# EasyEDA Pro project ProDoc_主板V6.0_2025-09-29.epro, board PCB8_4
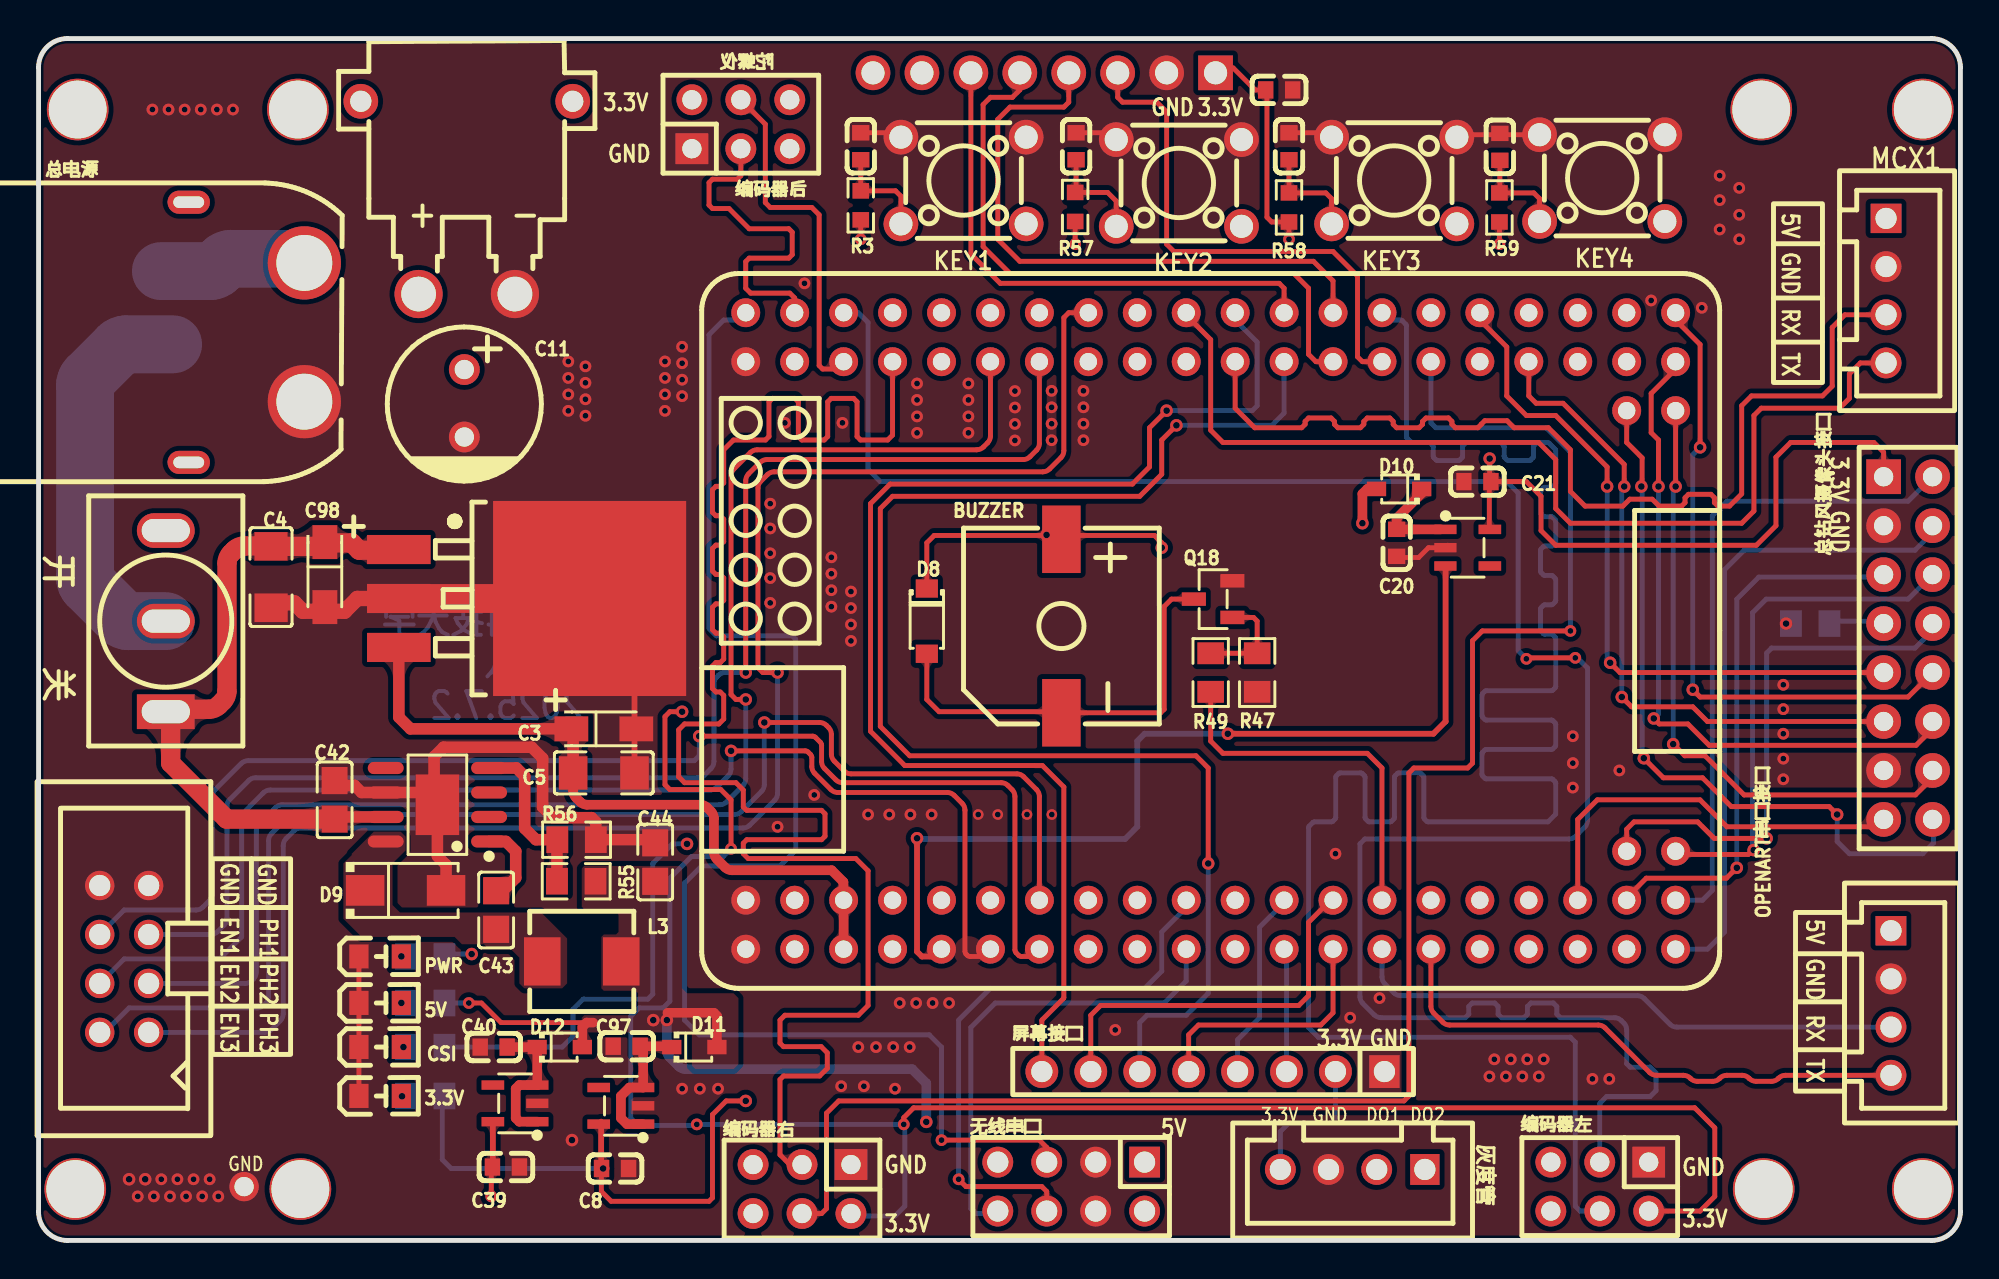
[diagram p1: board, top side]
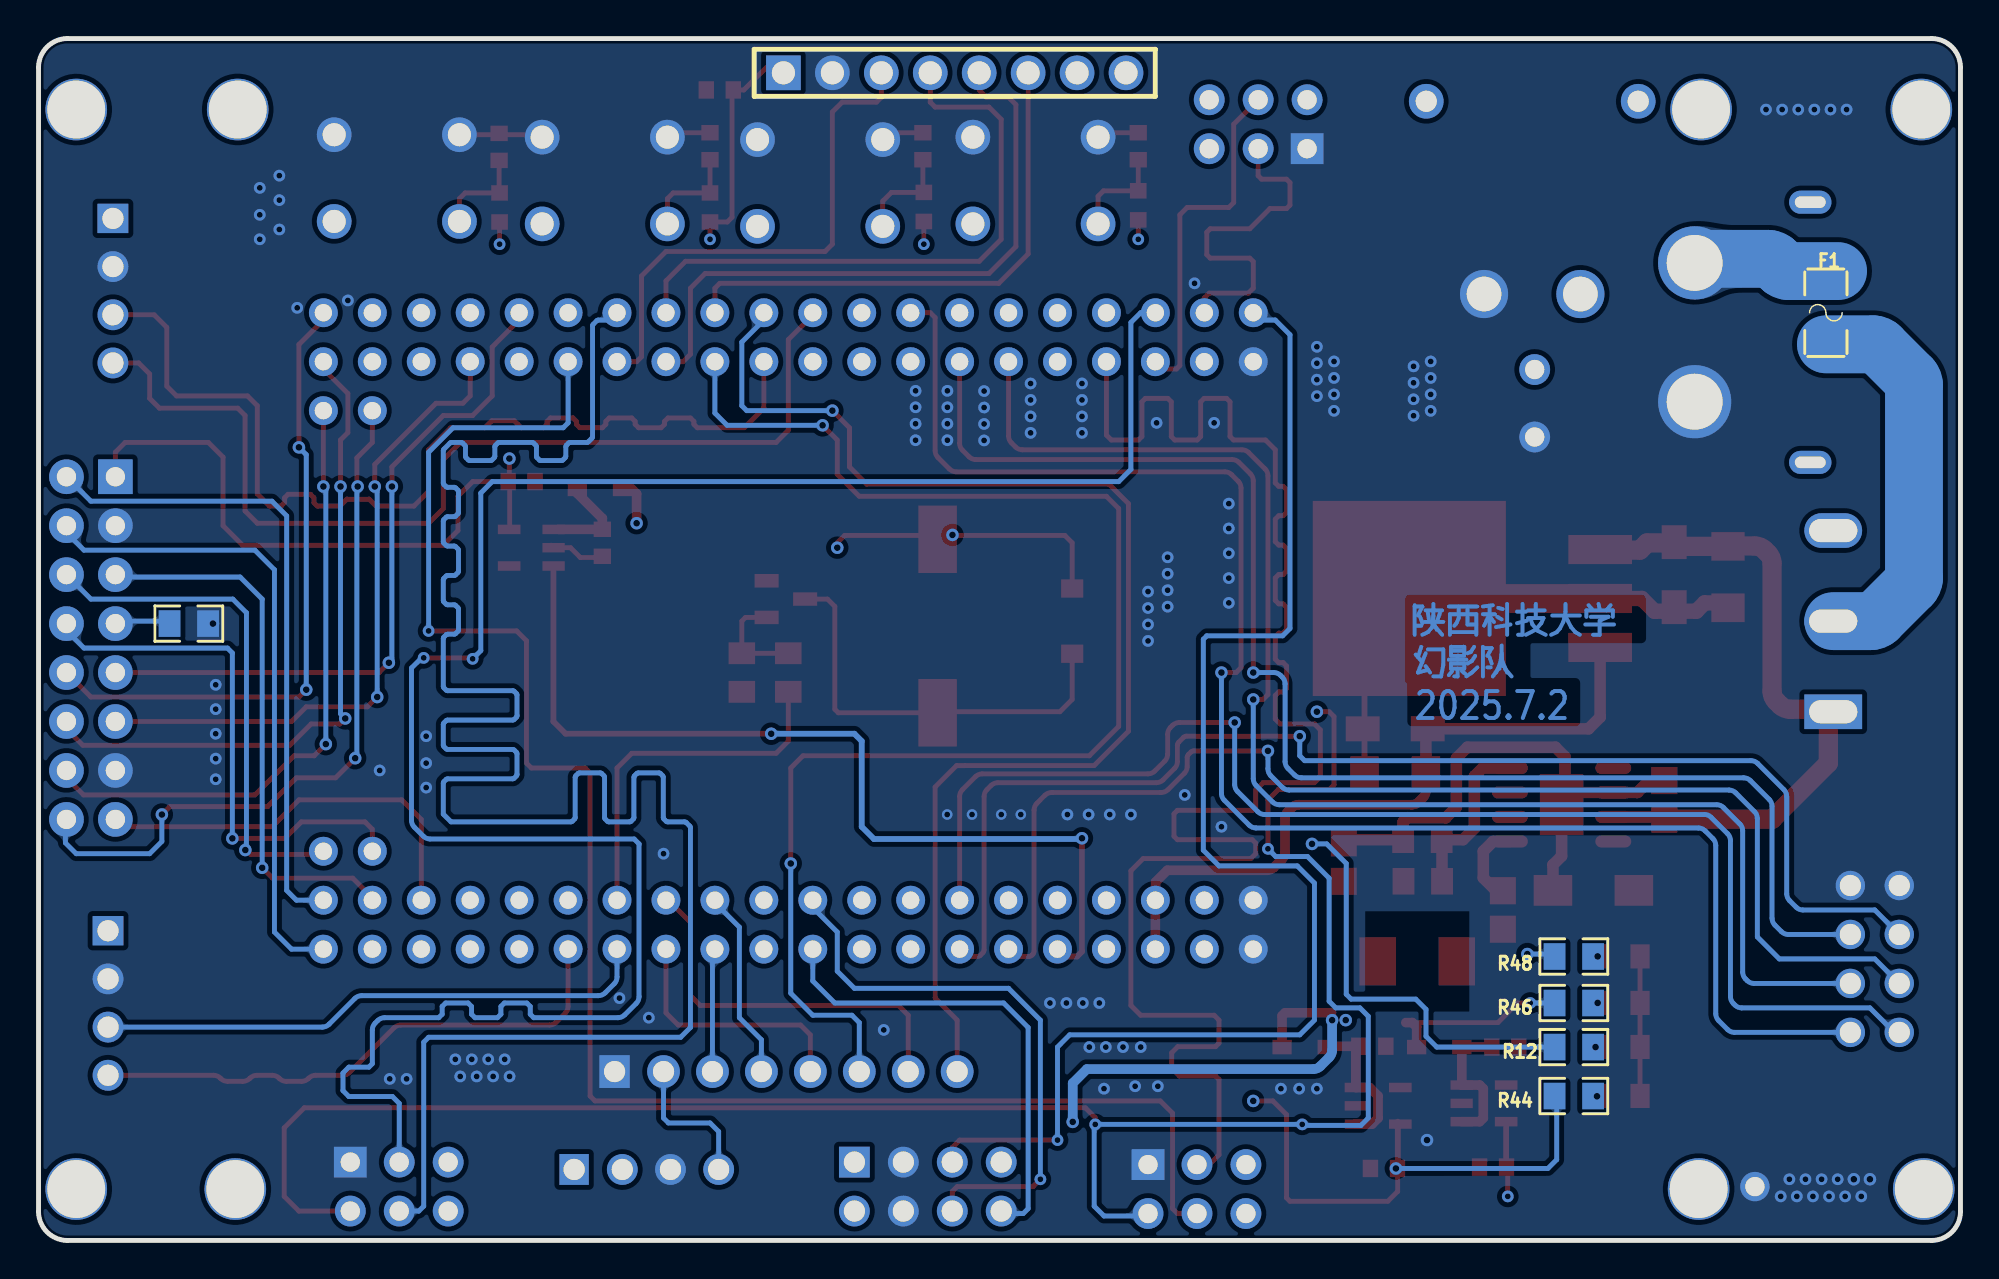
[diagram p2: board, bottom side, seen from below]

Outline 99.75 x 62.36 mm; copper layers: Top Layer, Inner1, Inner2, Bottom Layer. Coordinates in mm from the lower left corner of the outline.
Outline path: 0,60.86 0,1.5 arc(0.44,0.44) 1.5,0 98.25,0 arc(99.31,0.44) 99.75,1.5 99.75,60.86 arc(99.31,61.92) 98.25,62.36 1.5,62.36 arc(0.44,61.92) 0,60.86
Stack: Top Layer 0.035mm 外层铜厚1oz / Dielectric1 0.2104mm 7628 RC49% 8.6mil / Inner1 0.0152mm 内层铜厚 / Dielectric2 1.065mm 1.1mm H/HOZ Copper / Inner2 0.0152mm 内层铜厚 / Dielectric3 0.2104mm 7628 RC49% 8.6mil / Bottom Layer 0.035mm 外层铜厚1oz

## Design rules (mm)
net BM1_A: DP3
net BM2_A: DP2
net BM1_B: DP3
net BM3_A: DP1
net BM2_B: DP2
net BM3_B: DP1
template: 自定义配置
spacing copperThickness1oz (default): track to track 0.102, other pairs 0.152 to 0.3
spacing copperThickness2oz: track to track 0.203, other pairs 0.152 to 0.3
track width copperThickness1oz (default): min 0.127, default 0.254, max 4
track width copperThickness2oz: min 0.203, default 0.254, max 2.54
differential pair differentialPair (default): width min 0.127, default 0.254, max 2.54; gap min 0.152, default 0.152
via viaSize (default): diameter min 0.5, default 0.61, max 10; hole min 0.3, default 0.305, max 6.3

## Placement (name value [footprint] x y rotation side)
3.3V  -  [led_0805]  17.78 7.49 0 top
5V  -  [led_0805]  17.78 12.32 0 top
BUZZER  2.7kHz  [BUZ-SMD_L9.6-W9.6-LS10.0-R]  53.09 31.88 90 top
C2  100nF  [C0603]  42.67 56.77 90 top
C3  10uF  [CAP-SMD_L3.2-W1.6-RD-C7171]  29.34 26.54 0 top
C4  100nF  [C1206]  12.06 34.42 90 top
C5  100nF  [C1206]  29.34 24.26 180 top
C8  1uf  [C0603]  29.92 3.73 180 top
C11  220uF  [CAP-TH_BD8.0-P3.50-D0.5-FD]  22.1 43.43 270 top
C20  1uf  [C0603]  70.48 36.19 90 top
C21  1uf  [C0603]  74.68 39.37 0 top
C39  1uf  [C0603]  24.26 3.81 180 top
C40  1uf  [C0603]  23.62 10.03 0 top
C42  22uf  [C0805]  15.37 22.86 90 top
C43  10nF  [C0805]  23.75 17.14 270 top
C44  22uf  [C0805]  32 19.63 90 top
C95  100nF  [C0603]  53.85 56.77 90 top
C97  1uf  [C0603]  30.52 10.08 0 top
C98  10uF  [CAP-SMD_L3.2-W1.6-RD-C7171]  14.86 34.54 270 top
C99  100nF  [C0603]  64.9 56.77 90 top
C100  100nF  [C0603]  75.84 56.74 90 top
C101  100nF  [C0603]  64.39 59.69 0 top
CN7  XT30PW-M  [CONN-TH_XT30PW-M]  22.22 54.1 180 top
CSI  -  [led_0805]  17.78 10.03 0 top
D8  1N4148W  [SOD-123_L2.8-W1.8-LS3.7-RD]  46.1 32.13 270 top
D9  SS34  [SMA_L4.3-W2.5-LS5.0-RD]  19.05 18.16 0 top
D10  1N5819WS  [SOD-323_L1.8-W1.3-LS2.5-RD]  70.61 38.99 180 top
D11  1N5819WS  [SOD-323_L1.8-W1.3-LS2.5-RD]  34.04 10.03 0 top
D12  1N5819WS  [SOD-323_L1.8-W1.3-LS2.5-RD]  27.05 10.03 0 top
F1  R12.000.6  [F1206]  6.98 48.13 90 bottom
KEY1  TS665CJ  [SW-TH_4P-L6.0-W6.0-P4.50-LS6.5]  48.01 54.99 180 top
KEY2  TS665CJ  [SW-TH_4P-L6.0-W6.0-P4.50-LS6.5]  59.18 54.86 180 top
KEY3  TS665CJ  [SW-TH_4P-L6.0-W6.0-P4.50-LS6.5]  70.36 54.99 180 top
KEY4  TS665CJ  [SW-TH_4P-L6.0-W6.0-P4.50-LS6.5]  81.15 55.12 180 top
L3  10uH  [IND-SMD_L5.4-W5.2_FXL0530]  28.19 14.48 0 top
MCX串口接口  ZX-XH2.54-4PZZ  [CONN-TH_4P-P2.50_4PIN]  95.89 49.28 270 top
NOREF  -  [Pad_e85]  13.46 58.67 0 top
NOREF#2  -  [Pad_e4]  1.91 2.67 0 top
NOREF#3  -  [Pad_e79]  89.53 2.67 0 top
NOREF#4  -  [Pad_e82]  89.41 58.67 0 top
NOREF#5  -  [Pad_e78]  13.59 2.67 0 top
NOREF#6  -  [Pad_e1]  97.79 58.67 0 top
NOREF#7  -  [Pad_e3]  97.79 2.67 0 top
NOREF#8  -  [Pad_e5]  2.03 58.67 0 top
NOREF#9  -  [Pad_e1237]  10.67 2.79 0 top
OPENART串口接口  ZX-XH2.54-4PZZ  [CONN-TH_4P-P2.50_4PIN]  96.14 12.32 270 top
PWR  -  [led_0805]  17.78 14.73 0 top
Q18  S8050  [SOT-23-3_L2.9-W1.3-P1.90-LS2.4-BR]  60.96 33.27 0 top
R3  10K  [R0603]  42.67 53.7 270 top
R12  510  [R0805]  20.07 10.03 0 bottom
R44  510  [R0805]  20.07 7.49 0 bottom
R46  2k  [R0805]  20.07 12.32 0 bottom
R47  4.7k  [R0805]  63.25 29.46 90 top
R48  2k  [R0805]  20.07 14.73 0 bottom
R49  4.7k  [R0805]  60.83 29.46 90 top
R50  10K  [R0805]  91.95 32 0 bottom
R55  10k  [R0805]  27.91 18.63 0 top
R56  3.24k  [R0805]  27.92 20.79 180 top
R57  10K  [R0603]  53.8 53.62 270 top
R58  10K  [R0603]  64.9 53.59 270 top
R59  10K  [R0603]  75.82 53.59 270 top
U1  LM2940S-5.0/TR  [TO-263-3_L8.6-W10.2-P2.54-LS14.4-BR]  23.65 33.31 180 top
U15  HC-JN254-2-04-Z  [IDC-TH_8P-P2.54-V-R2-C4-S2.54]  4.44 14.6 90 top
U20  RT9013-33GB  [SOT-23-5_L3.0-W1.7-P0.95-LS2.8-BL]  74.17 35.94 270 top
U21  RT9013-33GB  [SOT-23-5_L3.0-W1.7-P0.95-LS2.8-BL]  30.23 6.98 90 top
U33  RT9013-33GB  [SOT-23-5_L3.0-W1.7-P0.95-LS2.8-BL]  24.73 7.11 90 top
U34  TPS5430DDA  [ESOP-8_L4.9-W3.9-P1.27-LS6.0-BL-EP-2]  20.7 22.61 90 top
U38  -  [NXPRT1064]  33.27 50.8 0 top
U39  MT-0-102-A101-M200-RS  [SW-TH_MT-0-103-A101-M200-RS]  6.6 32.13 90 top
U40  ZX-XH2.54-4PZZ  [CONN-TH_4P-P2.50_4PIN]  68.2 3.68 180 top
屏幕接口  PM254-1-08-Z-8.5  [HDR-TH_8P-P2.54-V-F]  60.96 8.76 180 top
总电源  XT60PW-M  [CONN-TH_XT60PW-M]  10.8 47.12 0 top
总钻风摄像头接口  PM254-2-08-Z-8.5  [HDR-TH_16P-P2.54-V-F-R2-C8-S2.54]  97.03 30.73 270 top
无线串口  -  [HDR-TH_8P-P2.54-V-F-R2-C4-S2.54-1]  53.59 2.79 180 top
编码器右  -  [HDR-TH_6P-P2.54-V-F-R2-C3-S2.54]  39.62 2.67 180 top
编码器后  -  [HDR-TH_6P-P2.54-V-F-R2-C3-S2.54]  36.45 57.91 0 top
编码器左  -  [HDR-TH_6P-P2.54-V-F-R2-C3-S2.54]  81.03 2.79 180 top
陀螺仪  -  [HDR-TH_8P-P2.54-V-F-1]  52.2 60.58 180 bottom

## Footprints (pads in the part's own frame, mm; a bottom-side part is the same pattern mirrored in y, then rotated)
BUZ-SMD_L9.6-W9.6-LS10.0-R
  rect 3.5x2 smd: 1(4.5,0) 2(-4.5,0)
C0603
  rect 0.8x0.9 smd: 1(-0.7,0) 2(0.7,0)
C0805
  rect 1.41x1.35 smd: 1(-1,0) 2(1,0)
C1206
  rect 1.485x1.728 smd: 1(-1.593,0) 2(1.593,0)
CAP-SMD_L3.2-W1.6-RD-C7171
  rect 1.758x1.296 smd: 1(-1.687,0) 2(1.687,0)
CAP-TH_BD8.0-P3.50-D0.5-FD
  round 1.6 hole 1: 1(-1.75,0) 2(1.75,0)
CONN-TH_4P-P2.50_4PIN
  rect 1.524x1.6 hole 1.1: 1(-3.75,0)
  round 1.6 hole 1.1: 2(-1.25,0) 3(1.25,0) 4(3.75,0)
CONN-TH_XT30PW-M
  round 2.5 hole 1.8: 1(-2.5,5) 2(2.5,5)
  round 1.8 hole 1.1: 3(5.5,-5) 4(-5.5,-5)
CONN-TH_XT60PW-M
  round 3.8 hole 2.9: 1(3,-3.6) 2(3,3.6)
  oval 2.2x1.2 hole 1.6x0.6: 3(-3,6.75) 4(-3,-6.75)
ESOP-8_L4.9-W3.9-P1.27-LS6.0-BL-EP-2
  oval 0.63x1.865 smd: 1(-1.905,-2.683) 2(-0.635,-2.683) 3(0.635,-2.683) 4(1.905,-2.683) 5(1.905,2.683) 6(0.635,2.683) 7(-0.635,2.683) 8(-1.905,2.683)
  rect 3.15x2.26 smd: 9(0,0)
F1206
  rect 1.19x1.728 smd: 1(-1.445,0) 2(1.445,0)
HDR-TH_6P-P2.54-V-F-R2-C3-S2.54
  rect 1.7x1.6 hole 1: 1(-2.54,-1.27)
  round 1.6 hole 1: 2(-2.54,1.27) 3(0,-1.27) 4(0,1.27) 5(2.54,-1.27) 6(2.54,1.27)
HDR-TH_8P-P2.54-V-F
  rect 1.575x1.7 hole 1.1: 1(-8.89,0)
  round 1.7 hole 1.1: 2(-6.35,0) 3(-3.81,0) 4(-1.27,0) 5(1.27,0) 6(3.81,0) 7(6.35,0) 8(8.89,0)
HDR-TH_8P-P2.54-V-F-1
  rect 1.8x1.8 hole 1.2: 1(-8.89,0)
  round 1.8 hole 1.2: 2(-6.35,0) 3(-3.81,0) 4(-1.27,0) 5(1.27,0) 6(3.81,0) 7(6.35,0) 8(8.89,0)
HDR-TH_8P-P2.54-V-F-R2-C4-S2.54-1
  rect 1.6x1.6 hole 1.1: 1(-3.81,-1.27)
  round 1.6 hole 1.1: 2(-3.81,1.27) 3(-1.27,-1.27) 4(-1.27,1.27) 5(1.27,-1.27) 6(1.27,1.27) 7(3.81,-1.27) 8(3.81,1.27)
HDR-TH_16P-P2.54-V-F-R2-C8-S2.54
  rect 1.8x1.8 hole 1: 1(-8.89,-1.27)
  round 1.8 hole 1: 2(-8.89,1.27) 3(-6.35,-1.27) 4(-6.35,1.27) 5(-3.81,-1.27) 6(-3.81,1.27) 7(-1.27,-1.27) 8(-1.27,1.27) 9(1.27,-1.27) 10(1.27,1.27) 11(3.81,-1.27) 12(3.81,1.27) 13(6.35,-1.27) 14(6.35,1.27) 15(8.89,-1.27) 16(8.89,1.27)
IDC-TH_8P-P2.54-V-R2-C4-S2.54
  round 1.524 hole 1.1: 1(-3.81,-1.27) 2(-3.81,1.27) 3(-1.27,-1.27) 4(-1.27,1.27) 5(1.27,-1.27) 6(1.27,1.27) 7(3.81,-1.27) 8(3.81,1.27)
IND-SMD_L5.4-W5.2_FXL0530
  rect 1.9x2.5 smd: 1(-2.05,0) 2(2.05,0)
led_0805
  rect 1x1.25 smd: 1(-1.15,0.005) 2(1.05,0.005)
NXPRT1064
  round 1.5 hole 0.9: 1(3.429,-35.687) 2(3.429,-33.147) 3(5.969,-35.687) 4(5.969,-33.147) 5(8.509,-35.687) 6(8.509,-33.147) 7(11.049,-35.687) 8(11.049,-33.147) 9(13.589,-35.687) 10(13.589,-33.147) 11(16.129,-35.687) 12(16.129,-33.147) 13(18.669,-35.687) 14(18.669,-33.147) 15(21.209,-35.687) 16(21.209,-33.147) 17(23.749,-35.687) 18(23.749,-33.147) 19(26.289,-35.687) 20(26.289,-33.147) 21(28.829,-35.687) 22(28.829,-33.147) 23(31.369,-35.687) 24(31.369,-33.147) 25(33.909,-35.687) 26(33.909,-33.147) 27(36.449,-35.687) 28(36.449,-33.147) 29(38.989,-35.687) 30(38.989,-33.147) 31(41.529,-35.687) 32(41.529,-33.147) 33(44.069,-35.687) 34(44.069,-33.147) 35(46.609,-35.687) 36(46.609,-33.147) 37(49.149,-35.687) 38(49.149,-33.147) 39(51.689,-35.687) 40(51.689,-33.147) 41(49.149,-30.607) 42(51.689,-30.607) 43(51.689,-7.747) 44(49.149,-7.747) 45(51.689,-5.207) 46(51.689,-2.667) 47(49.149,-5.207) 48(49.149,-2.667) 49(46.609,-5.207) 50(46.609,-2.667) 51(44.069,-5.207) 52(44.069,-2.667) 53(41.529,-5.207) 54(41.529,-2.667) 55(38.989,-5.207) 56(38.989,-2.667) 57(36.449,-5.207) 58(36.449,-2.667) 59(33.909,-5.207) 60(33.909,-2.667) 61(31.369,-5.207) 62(31.369,-2.667) 63(28.829,-5.207) 64(28.829,-2.667) 65(26.289,-5.207) 66(26.289,-2.667) 67(23.749,-5.207) 68(23.749,-2.667) 69(21.209,-5.207) 70(21.209,-2.667) 71(18.669,-5.207) 72(18.669,-2.667) 73(16.129,-5.207) 74(16.129,-2.667) 75(13.589,-5.207) 76(13.589,-2.667) 77(11.049,-5.207) 78(11.049,-2.667) 79(8.509,-5.207) 80(8.509,-2.667) 81(5.969,-5.207) 82(5.969,-2.667) 83(3.429,-5.207) 84(3.429,-2.667)
Pad_e1
  round 3.2 hole 3: 1(0,0)
Pad_e3
  round 3.2 hole 3: 1(0,0)
Pad_e4
  round 3.2 hole 3: 1(0,0)
Pad_e5
  round 3.2 hole 3: 1(0,0)
Pad_e78
  round 3.2 hole 3: 1(0,0)
Pad_e79
  round 3.2 hole 3: 1(0,0)
Pad_e82
  round 3.2 hole 3: 1(0,0)
Pad_e85
  round 3.2 hole 3: 1(0,0)
Pad_e1237
  round 1.524 hole 1: 1(0,0)
R0603
  rect 0.806x0.864 smd: 1(-0.753,0) 2(0.753,0)
R0805
  rect 1.133x1.377 smd: 1(-1,0) 2(1,0)
SMA_L4.3-W2.5-LS5.0-RD
  rect 2x1.593 smd: 1(-2.1,0) 2(2.1,0)
SOD-123_L2.8-W1.8-LS3.7-RD
  rect 0.95x1.15 smd: 1(-1.692,0) 2(1.692,0)
SOD-323_L1.8-W1.3-LS2.5-RD
  rect 1x0.75 smd: 1(-1.173,0) 2(1.173,0)
SOT-23-3_L2.9-W1.3-P1.90-LS2.4-BR
  rect 1.25x0.7 smd: 1(1,-0.95) 2(1,0.95) 3(-1,0)
SOT-23-5_L3.0-W1.7-P0.95-LS2.8-BL
  rect 0.49x1.157 smd: 1(-0.95,-1.153) 2(0,-1.153) 3(0.95,-1.153)
  rect 0.49x1.175 smd: 4(0.95,1.153) 5(-0.95,1.153)
SW-TH_4P-L6.0-W6.0-P4.50-LS6.5
  round 1.8 hole 1.2: 1(-3.25,2.25) 2(3.25,2.25) 3(-3.25,-2.25) 4(3.25,-2.25)
SW-TH_MT-0-103-A101-M200-RS
  rect 1.8x3 hole 1.2x2.5: 1(-4.7,0)
  oval 1.8x3 hole 1.2x2.5: 2(0,0) 3(4.7,0)
TO-263-3_L8.6-W10.2-P2.54-LS14.4-BR
  rect 3.3x1.511 smd: 1(4.952,-2.54) 2(4.952,0) 3(4.952,2.54)
  rect 10.02x10.122 smd: 4(-4.952,0)

## Nets
As in the schematic, except:
GND: 3.3V.1 5V.1 C2.2 C3.2 C4.1 C5.1 C8.1 C11.2 C20.1 C21.1 C39.1 C40.1 C42.2 C44.2 C95.2 C97.1 C98.2 C99.2 C100.2 C101.2 CN7.1 CSI.1 D9.2 KEY1.3 KEY1.4 KEY2.3 KEY2.4 KEY3.3 KEY3.4 KEY4.3 KEY4.4 MCX串口接口.2 NOREF#9.1 OPENART串口接口.2 PWR.1 Q18.2 R47.1 R50.1 R56.1 U1.2 U1.4 U15.7 U15.8 U20.2 U21.2 U33.2 U34.6 U34.9 U38.1 U38.2 U38.83 U40.3 屏幕接口.1 总电源.1 总钻风摄像头接口.3 总钻风摄像头接口.13 无线串口.3 无线串口.4 编码器右.1 编码器后.1 编码器左.1 陀螺仪.2

Pads without a net: CN7 3 4; NOREF 1; NOREF#2 1; NOREF#3 1; NOREF#4 1; NOREF#5 1; NOREF#6 1; NOREF#7 1; NOREF#8 1; U20 4; U21 4; U33 4; U34 2 3 5; U39 3; 总电源 3 4; 无线串口 1 7; 编码器右 5 6; 编码器后 5 6; 编码器左 5 6; 陀螺仪 7 8

## Via types
v1: diameter 0.61, hole 0.305, Top Layer to Bottom Layer, 133 vias
v2: diameter 0.55, hole 0.305, Top Layer to Bottom Layer, 4 vias
v3: diameter 0.65, hole 0.35, Top Layer to Bottom Layer, 47 vias

## Routing (per net, layer and track width the routed paths; a pad name or vN(x,y) marks a point on that pad's centre or on a via; arc(x,y) is an arc through that point)
3.3V: length 192.1
  Top Layer w0.254: R57.2 v1(53.8,51.69) ; v3(58.29,35.94) 58.29,36.19 57.91,36.58 53.28,36.58 BUZZER.1 ; v1(75.82,51.69) R59.2 ; v3(29.3,3.73) 29.21,3.64 29.21,2.54 29.72,2.03 34.8,2.03 34.98,2.21 34.98,6.53 35.69,7.24 v3(36.7,7.24) ; 61.09,60.83 62,60.83 63.14,59.69 63.5,59.69 63.75,59.44 63.75,53.09 64,52.84 R58.2 v1(64.9,51.94) ; R3.2 v1(42.67,51.94) ; v3(52.31,36.6) 52.29,36.58 46.48,36.58 46.1,36.19 D8.1
  Top Layer w0.3: 29.2,6.16 29.2,3.84 v3(29.3,3.73)
  Inner1 w0.254: 53.85,51.05 53.85,51.64 v1(53.8,51.69) ; 53.85,51.05 54.1,50.8 64.64,50.8 64.9,51.05 ; 53.85,51.05 53.59,50.8 43.31,50.8 43.05,50.55 ; 43.05,50.55 43.05,41.15 43.81,40.39 52.2,40.39 52.31,40.27 v3(52.31,36.6) ; 43.05,50.55 42.67,50.93 v1(42.67,51.94) ; 64.9,51.05 v1(64.9,51.94) ; 64.9,51.05 65.15,50.8 75.56,50.8 75.82,51.05 v1(75.82,51.69) ; v3(58.29,35.94) 58.29,13.08 58.93,12.45 66.67,12.45 67.31,11.81 屏幕接口.2 67.18,8.64 67.18,7.75 66.67,7.24 v3(36.7,7.24)
  Bottom Layer w0.254: v3(29.3,3.73) 21.41,3.73 20.95,4.19 20.95,7.38 R44.2 ; U40.4 64.45,5.65 64.9,6.1 67.06,6.1 67.31,6.35 屏幕接口.2
+5V: length 187
  Top Layer w0.25: v1(22.33,12.32) 22.99,12.32 24,11.3 28.45,11.3
  Top Layer w0.5: v3(68.71,37.21) 68.71,38.73 68.96,38.99 D10.2 ; 32.64,11.81 35.05,11.81 35.21,11.65 D11.2 ; D12.2 28.22,11.08 28.45,11.3 28.78,11.3
  Inner1 w0.5: OPENART串口接口.1 92.9,16.07 91.82,17.14 91.82,33.27 ; v3(46.07,6.15) 59.51,6.15 60.07,5.59 60.07,2.02 59.57,1.52 无线串口.2 ; 91.82,33.27 69.1,33.27 68.71,33.67 v3(68.71,37.21) 56.85,37.21 arc(56.66,37.17) 56.5,37.06 56.41,36.98 arc(56.3,36.81) 56.26,36.62 56.26,20.4 arc(56.22,20.21) 56.11,20.05 55.77,19.7 arc(55.61,19.6) 55.42,19.56 34.72,19.56 arc(34.53,19.52) 34.37,19.41 34.31,19.35 arc(34.2,19.19) 34.16,19 34.16,12.47 arc(34.12,12.28) 34.02,12.12 33.48,11.58 arc(33.31,11.47) 33.12,11.43 v3(32.61,11.43) v3(31.9,11.43) ; 91.82,33.27 91.82,52.58 92.27,53.03 MCX串口接口.1
  Bottom Layer w0.254: v1(22.33,12.32) R46.2
  Bottom Layer w0.5: v3(32.61,11.43) 32.61,9.86 arc(32.65,9.67) 32.76,9.51 33.23,9.04 arc(33.39,8.93) 33.58,8.89 45.34,8.89 46.07,8.16 v3(46.07,6.15)
+5V_1064: length 37.3
  Top Layer w0.5: 41.78,14.73 41.78,17.06 arc(41.74,17.26) 41.64,17.42 41.77,17.55 41.77,18.6 41.16,19.21 35.99,19.21 arc(35.8,19.24) 35.64,19.35 35.2,19.79 arc(35.09,19.95) 35.05,20.15 35.05,21.9 arc(35.01,22.09) 34.91,22.25 34.7,22.46 arc(34.54,22.57) 34.34,22.61 28.47,22.61 arc(28.28,22.64) 28.12,22.75 27.89,22.98 arc(27.78,23.14) 27.74,23.33 27.74,24.13
  Top Layer w0.6: U1.3 18.7,27.15 19.3,26.54 C3.1 27.74,26.45 27.74,24.13
GND: length 77.3
  Top Layer w0.254: KEY3.4 66.88,57.47 C99.2 ; 73.14,36.07 U20.2 72.14,35.94 71.63,35.43 70.55,35.43 C20.1 ; KEY2.4 55.58,57.47 C95.2 ; KEY1.4 44.53,57.47 C2.2 ; KEY4.4 73.73,57.37 KEY3.3 ; 16.63,14.74 5V.1 CSI.1 3.3V.1
  Top Layer w0.3: U1.4 30.93,30.98 30.93,23.88
  Top Layer w0.6: D9.2 21.15,19.49 20.7,19.94 U34.9 ; 15.49,23.61 16.4,23.61 16.76,23.24 U34.6 20.07,23.24 20.53,22.78 20.53,25.1 21.02,25.59 25.59,25.59 26.16,25.02 26.16,22.48 26.71,21.93 28.7,21.93 28.92,21.71 R56.1 31.84,20.79 C44.2
  Top Layer w0.8: 11.81,32.82 12.06,33.08 13.28,33.08 13.71,32.65 15.88,32.65 16.54,33.31 18.19,33.31 18.45,33.56 U1.2
  Top Layer w1.5: U1.2 U1.4
  vias: v1(5.15,2.29) v1(5.91,58.67) v1(5.98,2.29) v1(6.37,3.17) v1(6.75,58.67) v1(6.82,2.29) v1(7.21,3.17) v1(7.58,58.67) v1(7.66,2.29) v1(8.04,3.17) v1(8.42,58.67) v1(8.49,2.29) v1(8.88,3.17) v1(9.26,58.67) v1(9.33,2.29) v1(10.09,58.67) v1(27.5,45.6) v1(27.5,44.75) v1(27.5,43.9) v1(27.5,43.04) v1(28.38,45.35) v1(28.38,44.5) v1(28.38,43.64) v1(28.38,42.79) v1(32.51,45.6) v1(32.51,44.75) v1(32.51,43.9) v1(32.51,43.04) v1(33.4,46.37) v1(33.4,45.51) v1(33.4,44.66) v1(33.4,43.8) v1(33.4,7.87) v1(34.32,7.87) v1(35.27,7.87) v1(37.97,38.23) v1(37.97,36.94) v1(37.97,35.65) v1(37.97,34.36) v1(37.97,33.08) v1(38.35,21.46) v1(38.73,42.42) v1(39.75,49.66) v1(40.26,23.11) v1(41.15,35.44) v1(41.15,34.59) v1(41.15,33.74) v1(41.15,32.88) v1(41.66,8) v1(41.72,42.42) v1(42.16,33.67) v1(42.16,32.81) v1(42.16,31.96) v1(42.16,31.1) v1(42.55,10.03) v1(42.83,8) v1(43.05,22.1) v1(43.46,10.03) v1(44.15,22.1) v1(44.36,10.03) v1(44.45,7.87) v1(44.69,12.32) v1(45.25,22.1) v1(45.21,10.03) v1(45.59,44.46) v1(45.59,43.61) v1(45.59,42.75) v1(45.59,41.9) v1(45.55,12.32) v1(46.35,22.1) v1(46.4,12.32) v1(47.25,12.32) v1(48.26,44.46) v1(48.26,43.61) v1(48.26,42.75) v1(48.26,41.9) v1(50.67,44.07) v1(50.67,43.21) v1(50.67,42.36) v1(50.67,41.51) v1(52.58,44.08) v1(52.58,43.23) v1(52.58,42.37) v1(52.58,41.52) v1(54.23,44.08) v1(54.23,43.23) v1(54.23,42.37) v1(54.23,41.52) v1(55.88,10.92) v1(67.31,20.07) v1(68.07,11.56) v1(69.6,12.57) v1(75.3,8.51) v1(75.55,9.4) v1(76.15,8.51) v1(76.41,9.4) v1(77.01,8.51) v1(77.26,9.4) v1(77.86,8.51) v1(78.12,9.4) v1(79.63,26.16) v1(79.63,24.76) v1(79.63,23.49) v1(80.64,8.38) v1(81.52,8.38) v1(82.04,24.38) v1(83.69,48.77) v1(86.32,48.39) v1(87.25,55.24) v1(87.25,53.97) v1(87.25,52.45) v1(88.27,54.61) v1(88.27,53.21) v1(88.27,51.94) v1(90.55,28.83) v1(90.55,27.57) v1(90.55,26.29) v1(90.55,25) v1(90.55,23.93) v2(48.77,22.1) v2(49.78,22.1) v2(51.3,22.1) v2(52.59,22.1) v3(4.7,3.17) v3(5.53,3.17) v3(27.69,5.21) v3(90.69,32)
VIN: length 118.9
  Top Layer w0.6: 15.86,21.97 U34.7
  Top Layer w1: C42.1 9.76,21.86 6.86,24.76 6.86,26.86 arc(7.06,27.35) 7.56,27.56 8.85,27.56 arc(9.12,27.61) 9.35,27.76 9.57,27.99 arc(9.73,28.22) 9.78,28.48 9.78,35.14 arc(9.83,35.41) 9.98,35.64 10.17,35.82 arc(10.4,35.98) 10.67,36.03 11.79,36.03 11.81,36.01 14.81,36.01 14.99,36.19 16.26,36.19 16.64,35.81 18.67,35.81 U1.1
  Inner1 w0.254: 6.86,27.81 6.98,27.68 6.98,23.75 7.37,23.37 10.87,23.37 11.38,22.86 11.38,18.09 11.56,17.91 22.22,17.91 22.48,17.65 v3(22.48,14.86)
  Inner1 w2: CN7.2 19.72,53.85 arc(19.69,54.05) 19.58,54.21 18.05,55.73 arc(17.89,55.84) 17.7,55.88 4.78,55.88 arc(4.59,55.84) 4.43,55.73 2.18,53.49 arc(2.07,53.32) 2.03,53.13 2.03,29.04 arc(2.07,28.84) 2.18,28.68 3.28,27.58 arc(3.44,27.47) 3.64,27.43 8.25,27.43
  Bottom Layer w0.254: R48.2 21.19,14.86 v3(22.48,14.86)
14B: length 20.1
  Inner2 w0.254: U40.2 69.47,3.7 69.47,5.46 69.98,5.97 72.77,5.97 73.28,6.48 73.28,11.81 72.77,12.32 71.37,12.32 70.99,12.7 70.99,17.4 71.25,17.65 U38.30
9013EN: length 48.1
  Top Layer w0.3: v3(61.72,26.29) 72.39,26.29 73.02,26.92 73.02,34.99 72.76,34.99 ; v3(45.59,20.87) 45.59,14.99 45.85,14.73 46.86,14.73
  Bottom Layer w0.3: v3(61.72,26.29) 57.4,26.29 57.02,25.91 57.02,21.46 56.39,20.83 45.59,20.83
ADC2: length 16.8
  Inner2 w0.254: U38.32 73.79,17.65 73.53,17.4 73.53,12.32 73.97,11.89 73.97,6.02 73.41,5.46 72.26,5.46 71.95,5.15 U40.1
B0: length 6
  Bottom Layer w0.254: 屏幕接口.3 64.77,14.6 64.64,14.73
B1: length 9.7
  Bottom Layer w0.254: 屏幕接口.4 62.23,10.41 63.37,11.56 63.37,16.26 64.39,17.27 64.64,17.27
B2: length 12.8
  Top Layer w0.254: 67.18,14.73 67.18,11.81 66.55,11.18 60.2,11.18 59.69,10.67 屏幕接口.5
B3: length 20
  Top Layer w0.254: 屏幕接口.7 54.61,11.68 55.12,12.19 65.4,12.19 65.91,12.7 65.91,16.51 66.67,17.27 67.18,17.27
B12: length 28.3
  Top Layer w0.254: OPENART串口接口.4 90.67,8.57 arc(90.47,8.53) 90.31,8.42 90.29,8.4 arc(90.13,8.29) 89.94,8.25 89.14,8.25 arc(88.95,8.29) 88.79,8.4 88.77,8.42 arc(88.6,8.53) 88.41,8.57 87.62,8.57 arc(87.43,8.53) 87.26,8.42 87.24,8.4 arc(87.08,8.29) 86.89,8.25 86.09,8.25 arc(85.9,8.29) 85.74,8.4 85.72,8.42 arc(85.56,8.53) 85.36,8.57 83.97,8.57 arc(83.78,8.61) 83.61,8.72 81.3,11.03 arc(81.14,11.14) 80.95,11.18 73.23,11.18 arc(73.04,11.21) 72.88,11.32 72.41,11.79 arc(72.3,11.95) 72.26,12.14 72.26,14.73
B13: length 28.6
  Bottom Layer w0.254: OPENART串口接口.3 85.02,11.07 arc(84.83,11.11) 84.67,11.22 83.33,12.55 arc(83.17,12.66) 82.98,12.7 70.69,12.7 arc(70.5,12.74) 70.34,12.85 69.87,13.32 arc(69.76,13.48) 69.72,13.67 69.72,14.73
B15: length 19.3
  Top Layer w0.254: R49.1 60.83,25.91 61.47,25.27 68.96,25.27 69.72,24.51 69.72,17.27
B20: length 21.6
  Top Layer w0.254: 总钻风摄像头接口.15 95.38,21.46 87.63,21.46 86.23,22.86 80.9,22.86 79.88,21.84 79.88,17.27
B22: length 29
  Top Layer w0.254: 82.42,17.27 82.42,17.78 83.44,18.8 87.6,18.8 v3(88.14,19.33)
  Bottom Layer w0.254: 总钻风摄像头接口.5 95.63,34.42 89.28,34.42 88.14,33.27 v3(88.14,19.33)
B24: length 33.8
  Bottom Layer w0.254: U38.40 86.36,17.65 86.87,18.16 86.87,37.59 87.63,38.35 97.03,38.35 总钻风摄像头接口.2
B25: length 33.7
  Bottom Layer w0.254: 总钻风摄像头接口.4 98.3,36.72 97.39,35.81 88.52,35.81 87.5,34.8 87.5,16 86.61,15.11 U38.39
B26: length 26.7
  Top Layer w0.254: v3(89.01,20.25) 88.96,20.25 88.73,20.03 85.18,20.03 84.96,19.81
  Bottom Layer w0.254: 总钻风摄像头接口.6 97.03,33.27 89.66,33.27 88.96,32.57 88.96,20.31 v3(89.01,20.25)
B27: length 28.6
  Top Layer w0.254: v3(89.69,20.86) 86.96,20.86 86.11,21.72 82.8,21.72 82.42,21.34 82.42,19.81
  Bottom Layer w0.254: v3(89.69,20.86) 89.69,30.48 89.94,30.73 97.39,30.73 98.3,31.64 总钻风摄像头接口.8 ; 98.3,32.64 98.17,32.51
B28: length 33
  Top Layer w0.254: 84.96,47.75 86.23,46.48 v3(86.23,41.15) ; 总钻风摄像头接口.10 97.03,28.19 86.23,28.19 v3(85.85,28.57)
  Bottom Layer w0.254: v3(86.23,41.15) 85.85,40.77 v3(85.85,28.57)
B29: length 34.7
  Top Layer w0.254: v3(84.07,39.12) 84.07,41.53 83.69,41.91 83.69,43.94 84.96,45.21 ; v3(83.83,27.08) 84.11,26.8 85.6,26.8 86.7,25.69 97.45,25.69 98.3,26.54 总钻风摄像头接口.12
  Bottom Layer w0.254: v3(83.83,27.08) 84.07,27.33 v3(84.07,39.12)
B30: length 32.3
  Top Layer w0.254: 总钻风摄像头接口.14 98.31,24.37 98.31,24.01 97.41,23.11 88.52,23.11 86.49,25.15 85.44,25.15 v3(84.84,25.75) ; 84.96,42.67 v3(84.96,39.12)
  Bottom Layer w0.254: v3(84.96,39.12) 84.84,38.99 v3(84.84,25.75)
B31: length 37.4
  Top Layer w0.254: 82.42,42.67 82.42,41.4 83.23,40.6 83.23,39.12 ; v3(93.34,22.1) 92.93,22.51 87.85,22.51 86.36,24 84.33,24 v3(83.31,25.02)
  Bottom Layer w0.254: 83.23,39.12 83.23,25.11 v3(83.31,25.02) ; v3(93.34,22.1) 93.34,20.7 93.98,20.07 97.79,20.07 98.35,20.63 98.35,21.79 总钻风摄像头接口.16
  vias: v3(83.18,39.12)
BM1_A: length 18.3
  Top Layer w0.254: 编码器后.3 36.45,55.24 36.27,55.06 34.98,55.06 34.8,54.88 34.8,53.72 34.98,53.54 35.84,53.54 36.88,52.49 38.94,52.49 39.12,52.31 39.12,51.14 38.94,50.96 36.88,50.96 36.7,50.79 36.7,49.4 36.96,49.15 38.99,49.15 39.24,48.89 39.24,47.75
BM1_B: length 18.1
  Top Layer w0.254: 41.78,45.21 40.69,45.21 40.51,45.39 40.51,53.21 40.13,53.59 37.97,53.59 37.72,53.85 37.72,57.91 编码器后.4
BM2_A: length 111.3
  Top Layer w0.254: v1(77.22,30.17) 77.27,30.23 v1(79.76,30.23)
  Bottom Layer w0.254: 41.78,48.13 42.55,48.13 43.05,47.62 43.05,40 43.69,39.37 76.2,39.37 76.79,38.78 76.79,30.6 v1(77.22,30.17) ; v1(79.76,30.23) 79.86,30.23 80.39,29.7 80.39,21.8 arc(80.35,21.61) 80.24,21.44 79.78,20.97 arc(79.61,20.87) 79.42,20.83 68.83,20.83 68.58,20.57 68.58,12.65 arc(68.62,12.46) 68.73,12.3 69.32,11.7 arc(69.48,11.6) 69.68,11.56 74.05,11.56 74.23,11.74 74.23,12.14 74.4,12.32 75.57,12.32 75.75,12.14 75.75,11.74 75.93,11.56 77.09,11.56 77.27,11.74 77.27,12.14 77.45,12.32 78.62,12.32 78.8,12.14 78.8,11.74 78.98,11.56 81.79,11.56 arc(81.98,11.52) 82.14,11.41 82.28,11.27 arc(82.38,11.11) 82.42,10.92 82.42,9.17 82.6,8.99 83.64,8.99 83.95,8.68 83.95,7.77 83.64,7.47 81.38,7.47 81.03,7.11 编码器左.3
BM2_B: length 111.5
  Bottom Layer w0.254: 69.72,47.75 70.7,47.75 arc(70.74,47.74) 70.77,47.72 70.96,47.53 arc(70.99,47.49) 70.99,47.46 70.99,41.7 arc(71,41.66) 71.02,41.63 71.22,41.43 arc(71.25,41.41) 71.29,41.4 72.16,41.4 arc(72.2,41.39) 72.23,41.37 72.35,41.25 arc(72.37,41.22) 72.38,41.18 72.38,40.68 arc(72.39,40.64) 72.41,40.61 72.53,40.49 arc(72.56,40.47) 72.6,40.46 73.68,40.46 arc(73.72,40.47) 73.76,40.49 73.88,40.61 arc(73.9,40.64) 73.91,40.68 73.91,41.18 arc(73.91,41.22) 73.94,41.25 74.06,41.37 arc(74.09,41.39) 74.13,41.4 75.84,41.4 arc(75.88,41.39) 75.92,41.37 76.04,41.25 arc(76.06,41.22) 76.06,41.18 76.06,40.68 arc(76.07,40.64) 76.09,40.61 76.22,40.49 arc(76.25,40.47) 76.29,40.46 77.37,40.46 arc(77.41,40.47) 77.44,40.49 77.56,40.61 arc(77.58,40.64) 77.59,40.68 77.59,41.18 arc(77.6,41.22) 77.62,41.25 77.74,41.37 arc(77.77,41.39) 77.81,41.4 78.32,41.4 arc(78.36,41.39) 78.39,41.37 78.71,41.05 arc(78.73,41.02) 78.74,40.98 78.74,39.3 arc(78.73,39.26) 78.71,39.22 78.59,39.1 arc(78.56,39.08) 78.52,39.07 78.17,39.07 arc(78.13,39.07) 78.1,39.04 77.98,38.92 arc(77.96,38.89) 77.95,38.85 77.95,37.77 arc(77.96,37.73) 77.98,37.7 78.1,37.58 arc(78.13,37.56) 78.17,37.55 78.52,37.55 arc(78.56,37.54) 78.59,37.52 78.71,37.4 arc(78.73,37.37) 78.74,37.33 78.74,36.25 arc(78.73,36.21) 78.71,36.18 78.59,36.06 arc(78.56,36.03) 78.52,36.03 78.17,36.03 arc(78.13,36.02) 78.1,36 77.98,35.88 arc(77.96,35.84) 77.95,35.81 77.95,34.72 arc(77.96,34.69) 77.98,34.65 78.1,34.53 arc(78.13,34.51) 78.17,34.5 78.52,34.5 arc(78.56,34.49) 78.59,34.47 78.71,34.35 arc(78.73,34.32) 78.74,34.28 78.74,33.2 arc(78.73,33.16) 78.71,33.13 78.59,33.01 arc(78.56,32.99) 78.52,32.98 78.17,32.98 arc(78.13,32.97) 78.1,32.95 77.98,32.83 arc(77.96,32.8) 77.95,32.76 77.95,31.68 arc(77.96,31.64) 77.98,31.6 78.1,31.48 arc(78.13,31.46) 78.17,31.45 78.52,31.45 arc(78.56,31.45) 78.59,31.42 78.71,31.3 arc(78.73,31.27) 78.74,31.23 78.74,28.74 arc(78.73,28.71) 78.71,28.67 78.59,28.55 arc(78.56,28.53) 78.52,28.52 75.13,28.52 arc(75.1,28.51) 75.06,28.49 74.94,28.37 arc(74.92,28.34) 74.91,28.3 74.91,27.22 arc(74.92,27.18) 74.94,27.15 75.06,27.03 arc(75.1,27.01) 75.13,27 78.52,27 arc(78.56,26.99) 78.59,26.97 78.71,26.85 arc(78.73,26.82) 78.74,26.78 78.74,25.7 arc(78.73,25.66) 78.71,25.62 78.59,25.5 arc(78.56,25.48) 78.52,25.47 75.13,25.47 arc(75.1,25.47) 75.06,25.44 74.94,25.32 arc(74.92,25.29) 74.91,25.25 74.91,24.17 arc(74.92,24.13) 74.94,24.1 75.06,23.98 arc(75.1,23.96) 75.13,23.95 78.52,23.95 arc(78.56,23.94) 78.59,23.92 78.71,23.8 arc(78.73,23.77) 78.74,23.73 78.74,22.12 78.34,21.72 72.11,21.72 arc(72.08,21.72) 72.04,21.75 71.92,21.87 arc(71.9,21.9) 71.89,21.94 71.89,24.04 arc(71.89,24.07) 71.86,24.11 71.74,24.23 arc(71.71,24.25) 71.67,24.26 70.59,24.26 arc(70.55,24.25) 70.52,24.23 70.4,24.11 arc(70.38,24.07) 70.37,24.04 70.37,21.94 arc(70.36,21.9) 70.34,21.87 70.22,21.75 arc(70.19,21.72) 70.15,21.72 69.07,21.72 arc(69.03,21.72) 69,21.75 68.88,21.87 arc(68.85,21.9) 68.85,21.94 68.85,24.04 arc(68.84,24.07) 68.82,24.11 68.7,24.23 arc(68.66,24.25) 68.62,24.26 67.54,24.26 arc(67.5,24.25) 67.47,24.23 67.35,24.11 arc(67.33,24.07) 67.32,24.04 67.32,21.94 arc(67.31,21.9) 67.29,21.87 67.17,21.75 arc(67.14,21.72) 67.1,21.72 66.21,21.72 arc(66.17,21.71) 66.14,21.69 65.94,21.49 arc(65.92,21.46) 65.91,21.42 65.91,11.05 66.42,10.54 79.5,10.54 79.76,10.29 79.76,1.78 80.01,1.52 编码器左.4
BM3.3V: length 160.4
  Top Layer w0.254: 23.58,3.83 23.5,3.75 23.5,2.29 v1(23.49,2.29) ; 编码器左.2 86.23,1.52 86.99,2.29 86.99,5.84 85.95,6.88 45.42,6.88 44.9,6.37 v1(44.9,6.02) ; v1(35.94,20.32) 35.94,22.86 35.41,23.39 32.77,23.39 32.51,23.65 32.51,27.18 32.77,27.43 v3(33.4,27.43)
  Top Layer w0.3: 23.58,6.16 23.58,3.83
  Inner1 w0.254: 33.4,59.18 30.1,59.18 29.72,58.8 29.72,40.51 30.1,40.13 34.29,40.13 34.54,39.88 34.54,27.94 34.04,27.43 v3(33.4,27.43) ; v1(23.49,2.29) 23.49,2.24 24.14,1.6 33.98,1.6 34.16,1.78 v1(34.16,6.02)
  Bottom Layer w0.254: 编码器右.2 42.29,1.27 44.45,1.27 44.96,1.78 44.96,5.97 v1(44.9,6.02) v1(34.16,6.02) ; v1(35.94,20.32) 35.54,19.92 33.89,19.92 32.77,18.8 32.77,12.41 32.42,12.06 31.17,12.06 30.73,11.63 30.73,6.35 31.11,5.97 34.16,5.97
BM3_A: length 88.6
  Top Layer w0.254: 编码器右.3 39.55,4.01 38.92,4.01 38.48,4.44 38.48,8.35 38.66,8.53 40.54,8.53 40.93,8.93 40.93,9.74 40.62,10.06 38.66,10.06 38.48,10.23 38.48,11.43 38.73,11.68 42.55,11.68 43.05,12.19 43.05,19.18 42.42,19.81 36.83,19.81 36.58,20.07 36.58,20.61 36.76,20.79 40.64,20.79 40.82,20.97 40.82,22.14 40.64,22.31 36.76,22.31 36.58,22.49 36.58,23.37 36.2,23.75 33.53,23.75 33.22,24.06 33.22,26.49 33.53,26.8 35.31,26.8 35.56,27.05 35.56,28.28 35.38,28.46 35.15,28.46 34.97,28.64 34.97,29.8 35.15,29.98 35.38,29.98 35.56,30.16 35.56,31.32 35.38,31.5 35.15,31.5 34.97,31.68 34.97,32.85 35.15,33.03 35.38,33.03 35.56,33.21 35.56,34.37 35.38,34.55 35.15,34.55 34.97,34.73 34.97,35.9 35.15,36.08 35.38,36.08 35.56,36.26 35.56,37.42 35.38,37.6 35.15,37.6 34.97,37.78 34.97,38.94 35.15,39.12 35.38,39.12 35.56,39.3 35.56,41.02 36.07,41.53 37.73,41.53 37.91,41.71 37.91,43.51 38.09,43.69 39.25,43.69 39.43,43.51 39.43,41.71 39.61,41.53 40.78,41.53 40.96,41.71 40.96,43.51 41.14,43.69 42.3,43.69 42.48,43.51 42.48,41.71 42.66,41.53 44.07,41.53 44.32,41.78 44.32,45.21
BM3_B: length 88.8
  Top Layer w0.254: v1(79.5,31.62) 74.93,31.62 74.42,31.11 74.42,24.76 74.17,24.51 71.37,24.51 71.12,24.26 71.12,7.49 70.87,7.24 41.53,7.24 40.89,6.6 40.89,1.65 40.64,1.4 编码器右.4
  Bottom Layer w0.254: 72.26,45.21 72.26,42.42 72.52,42.16 78.23,42.16 79.5,40.89 v1(79.5,31.62)
C7: length 74.2
  Top Layer w0.254: v3(36.7,28.07) 36.2,28.07 35.94,28.32 35.94,39.67 arc(35.98,39.86) 36.09,40.02 36.94,40.87 arc(37.1,40.98) 37.29,41.02 48.69,41.02 arc(48.88,41.06) 49.04,41.17 49.26,41.38 arc(49.36,41.54) 49.4,41.74 49.4,45.21
  Bottom Layer w0.254: U15.3 10.71,13.33 arc(10.91,13.37) 11.07,13.48 11.16,13.57 arc(11.26,13.73) 11.3,13.92 11.3,21.26 arc(11.34,21.45) 11.45,21.61 12.3,22.46 arc(12.46,22.57) 12.65,22.61 35.35,22.61 arc(35.54,22.64) 35.71,22.75 36.56,23.6 arc(36.66,23.76) 36.7,23.96 v3(36.7,28.07)
C9: length 72.7
  Top Layer w0.254: v3(36.7,29.46) 36.7,39.42 arc(36.74,39.61) 36.85,39.77 37.45,40.37 arc(37.61,40.47) 37.8,40.51 51.1,40.51 arc(51.29,40.55) 51.45,40.66 51.8,41 arc(51.9,41.16) 51.94,41.35 51.94,45.21
  Bottom Layer w0.254: v3(36.7,29.46) 35.64,29.46 arc(35.45,29.43) 35.29,29.32 35.2,29.23 arc(35.09,29.07) 35.05,28.88 35.05,24.84 arc(35.01,24.65) 34.91,24.49 34.56,24.15 arc(34.4,24.04) 34.21,24 11.26,24 arc(11.06,23.96) 10.9,23.86 9.93,22.88 arc(9.82,22.72) 9.78,22.53 9.78,16.72 arc(9.74,16.53) 9.63,16.36 9.29,16.02 arc(9.13,15.91) 8.94,15.87 U15.5
C12: length 84.9
  Top Layer w0.254: v3(38.35,29.46) 37.59,29.46 37.34,29.72 37.34,39.04 arc(37.38,39.23) 37.48,39.39 37.83,39.73 arc(37.99,39.84) 38.18,39.88 52.12,39.88 arc(52.31,39.92) 52.47,40.02 53.07,40.62 arc(53.17,40.78) 53.21,40.97 53.21,47.88 53.47,48.13 54.48,48.13
  Bottom Layer w0.254: v3(38.35,29.46) 38.35,23.19 arc(38.32,23) 38.21,22.84 36.91,21.55 arc(36.75,21.44) 36.56,21.4 13.61,21.4 arc(13.41,21.36) 13.25,21.25 12.85,20.85 arc(12.74,20.69) 12.7,20.49 12.7,11.76 arc(12.66,11.57) 12.55,11.41 12.08,10.94 arc(11.92,10.83) 11.73,10.79 U15.1
C16: length 52
  Top Layer w0.254: 59.56,47.75 59.82,47.75 60.83,46.74 60.83,42.04 61.47,41.4 77.85,41.4 78.74,40.51 78.74,37.97 79.5,37.21 88.39,37.21 89.03,37.85 89.03,42.8 89.41,43.18 93.47,43.18 93.98,43.69 93.98,44.96 94.55,45.53 MCX串口接口.4
C17: length 50.9
  Top Layer w0.254: 62.1,45.21 62.1,43.18 63.12,42.16 65.55,42.16 65.73,42.34 65.73,42.49 65.91,42.67 67.08,42.67 67.26,42.49 67.26,42.34 67.44,42.16 68.6,42.16 68.78,42.34 68.78,42.49 68.96,42.67 70.13,42.67 70.31,42.49 70.31,42.34 70.48,42.16 71.65,42.16 71.83,42.34 71.83,42.49 72.01,42.67 73.17,42.67 73.35,42.49 73.35,42.34 73.53,42.16 74.7,42.16 74.88,42.34 74.88,42.35 75.06,42.53 76.22,42.53 76.58,42.16 78.36,42.16 79.5,41.02 79.5,38.86 80.26,38.1 82.23,38.1 82.58,38.46 83.75,38.46 84.11,38.1 85.27,38.1 85.45,38.28 85.45,38.53 85.63,38.71 86.8,38.71 86.98,38.53 86.98,38.28 87.15,38.1 87.76,38.1 88.39,38.73 88.39,43.31 88.9,43.81 92.58,43.81 93.09,44.32 93.09,47.37 93.75,48.03 MCX串口接口.3
C18: length 66.5
  Top Layer w0.254: 51.69,24.64 52.1,24.64 53.21,23.52 53.21,12.59 arc(53.21,12.57) 53.2,12.56 52.08,11.44 arc(52.07,11.43) 52.07,11.41 屏幕接口.8 ; v3(58.55,43.05) 57.66,42.16 57.66,40.13 56.77,39.24 44.2,39.24 43.18,38.23 43.18,26.42 44.96,24.64 51.67,24.64
  Bottom Layer w0.254: v3(58.55,43.05) 62.99,43.05 63.25,43.31 63.25,46.61 62.1,47.75
C19: length 74
  Top Layer w0.254: v3(59.05,42.29) 58.29,41.53 58.29,39.75 57.15,38.61 44.32,38.61 43.69,37.97 43.69,26.67 45.21,25.15 60.07,25.15 60.71,24.51 v3(60.71,19.56)
  Bottom Layer w0.254: 64.64,45.21 64.64,42.93 64.01,42.29 v3(59.05,42.29) ; 屏幕接口.6 57.15,11.3 57.53,11.68 59.56,11.68 60.71,12.83 v3(60.71,19.56)
C20: length 27.9
  Top Layer w0.254: 48.39,60.83 48.39,51.18 49.91,49.66 64.39,49.66 64.64,49.4 64.64,48.13
C21: length 33.4
  Top Layer w0.254: U38.59 66.29,45.59 65.91,45.97 65.91,49.4 65.15,50.16 50.42,50.16 49.02,51.56 49.02,58.93 49.4,59.31 50.55,59.31 50.93,59.69 50.93,60.83
C22: length 32
  Top Layer w0.254: 53.47,60.83 53.47,59.05 53.21,58.8 50.42,58.8 49.78,58.17 49.78,51.94 50.93,50.8 66.17,50.8 67.18,49.78 67.18,48.13
C23: length 27.4
  Top Layer w0.254: 56.01,60.83 56.01,59.31 56.26,59.05 58.04,59.05 58.55,58.55 58.55,51.69 58.93,51.31 67.18,51.31 68.45,50.04 68.45,45.85 68.71,45.59 U38.57
C28: length 35.9
  Top Layer w0.254: v3(81.41,39.12) 81.41,40.13 78.74,42.8 77.22,42.8 76.2,43.81 76.2,46.35 74.8,47.75 ; 总钻风摄像头接口.9 82.07,29.46 v3(81.56,29.97)
  Bottom Layer w0.254: v3(81.56,29.97) 81.41,30.13 v3(81.41,39.12)
C29: length 34.1
  Top Layer w0.254: 77.34,45.21 77.34,43.81 77.72,43.43 79.12,43.43 82.3,40.26 v3(82.3,39.12) ; 总钻风摄像头接口.11 86.61,26.92 85.85,27.69 82.68,27.69 v3(82.17,28.19)
  Bottom Layer w0.254: v3(82.3,39.12) 82.17,38.99 v3(82.17,28.19)
CSI3.3V: length 114.7
  Top Layer w0.254: 总钻风摄像头接口.1 95.76,40.89 95.25,41.4 90.93,41.4 90.17,40.64 90.17,37.08 89.15,36.07 78.74,36.07 77.98,36.83 77.98,38.61 77.22,39.37 75.3,39.37 ; 75.3,39.37 75.3,36.92 U20.5 ; 75.3,39.37 75.31,39.39 v3(75.31,40.57)
  Inner1 w0.254: v3(75.31,40.57) 71.55,40.57 71.37,40.39 71.37,38.73 71.12,38.48 54.99,38.48 54.36,37.85 54.36,24.26 54.1,24 34.16,24 33.65,23.49 v3(33.65,20.57)
  Bottom Layer w0.254: R12.2 27.18,10.03 27.74,10.59 27.74,11.99 28.27,12.52 31.62,12.52 31.88,12.77 31.88,19.56 32.89,20.57 v3(33.65,20.57)
D0: length 70.6
  Top Layer w0.254: 37.67,26.8 v3(37.67,26.87) 40.53,26.87 arc(40.73,26.83) 40.89,26.73 41,26.61 arc(41.11,26.45) 41.15,26.26 41.15,25.23 arc(41.19,25.03) 41.29,24.87 41.81,24.35 arc(41.98,24.25) 42.17,24.21 50.77,24.21 arc(50.96,24.17) 51.12,24.06 51.8,23.39 arc(51.9,23.23) 51.94,23.03 51.94,17.27
  Bottom Layer w0.254: U15.2 3.43,10.79 4.7,12.06 11.35,12.06 arc(11.54,12.1) 11.7,12.21 11.79,12.3 arc(11.9,12.46) 11.94,12.65 11.94,20.75 arc(11.98,20.94) 12.08,21.1 12.93,21.95 arc(13.1,22.06) 13.29,22.1 36.11,22.1 arc(36.31,22.14) 36.47,22.24 37.52,23.3 arc(37.63,23.46) 37.67,23.65 v3(37.67,26.87)
D1: length 66.9
  Top Layer w0.254: v3(34.29,26.16) 40.18,26.16 arc(40.25,26.15) 40.32,26.1 40.58,25.84 arc(40.62,25.77) 40.64,25.7 40.64,24.84 arc(40.68,24.65) 40.79,24.49 41.38,23.9 arc(41.54,23.79) 41.74,23.75 49.96,23.75 arc(50.15,23.71) 50.31,23.6 50.53,23.39 arc(50.63,23.23) 50.67,23.03 50.67,15.07 arc(50.69,14.99) 50.73,14.93 50.87,14.79 arc(50.93,14.75) 51.01,14.73 51.94,14.73
  Bottom Layer w0.254: U15.6 4.44,17.14 8.17,17.14 arc(8.37,17.18) 8.53,17.29 8.87,17.63 arc(8.98,17.8) 9.02,17.99 9.02,23.03 arc(9.06,23.23) 9.16,23.39 10.52,24.75 arc(10.68,24.85) 10.88,24.89 34.04,24.89 34.29,25.15 v3(34.29,26.16)
D3: length 64.7
  Top Layer w0.254: v3(35.94,25.4) 39.8,25.4 arc(39.87,25.38) 39.94,25.34 40.07,25.2 arc(40.12,25.14) 40.13,25.06 40.13,24.59 arc(40.17,24.4) 40.28,24.24 41.13,23.39 arc(41.29,23.28) 41.48,23.24 47.16,23.24 arc(47.36,23.2) 47.52,23.09 47.93,22.68 arc(48.04,22.52) 48.08,22.32 48.08,14.99 arc(48.1,14.92) 48.14,14.85 48.2,14.79 arc(48.27,14.75) 48.34,14.73 49.4,14.73
  Bottom Layer w0.254: U15.4 4.44,14.6 9.4,14.6 10.54,15.75 10.54,21.89 arc(10.58,22.08) 10.69,22.24 11.66,23.22 arc(11.83,23.33) 12.02,23.37 34.84,23.37 arc(35.04,23.41) 35.2,23.51 35.79,24.11 arc(35.9,24.27) 35.94,24.46 v3(35.94,25.4)
D12: length 44.2
  Inner2 w0.254: U38.15 53.59,15.11 53.21,15.49 53.21,39.24 53.72,39.75 54.86,39.75 55.63,40.51 55.63,50.04 54.99,50.67 51.56,50.67 51.26,50.98 KEY1.1
D13: length 43.2
  Inner2 w0.254: U38.16 54.48,37.85 55.24,38.61 62.23,38.61 63.37,39.75 63.37,50.16 62.36,51.18 62.36,52.54 KEY2.1
D14: length 54.6
  Inner2 w0.254: U38.17 56.01,15.11 55.75,15.37 55.75,35.94 57.4,37.59 66.04,37.59 66.67,38.23 66.67,42.8 67.18,43.31 72.9,43.31 73.53,43.94 73.53,52.67 KEY3.1
D15: length 60.5
  Inner2 w0.254: KEY4.1 84.25,52.72 84.25,51.49 83.87,51.11 79.17,51.11 78.74,50.67 78.74,42.93 77.98,42.16 68.45,42.16 67.82,41.53 67.82,37.21 67.44,36.83 57.91,36.83 57.02,35.94 U38.18
D16: length 24.4
  Bottom Layer w0.254: 59.56,14.73 59.56,13.46 58.42,12.32 49.66,12.32 48.39,11.05 48.39,1.65 48.64,1.4 49.66,1.4 无线串口.8
D17: length 29.5
  Top Layer w0.254: 无线串口.6 52.32,2.54 52.07,2.79 48.13,2.79 v1(47.75,3.17)
  Bottom Layer w0.254: 59.56,17.27 58.29,16 58.29,13.97 57.4,13.08 49.4,13.08 47.75,11.43 v1(47.75,3.17)
D26: length 71.8
  Top Layer w0.254: 无线串口.5 52.32,4.83 51.94,5.21 v1(46.86,5.21)
  Bottom Layer w0.254: 36.7,47.75 35.56,47.75 34.8,46.99 34.8,31.75 35.18,31.37 39.12,31.37 39.3,31.19 39.3,20.25 38.48,19.43 34.42,19.43 33.53,18.54 33.53,11.43 34.29,10.67 46.23,10.67 46.86,10.03 v1(46.86,5.21)
UVIN: length 21.2
  Inner1 w2: 总电源.2 15.83,50.72 16.76,49.78 16.76,45.47 17.43,44.8 21.72,44.8 C11.1
  Bottom Layer w3: 6.35,50.29 8.92,50.29 arc(9.11,50.33) 9.27,50.44 9.62,50.78 arc(9.78,50.89) 9.97,50.93 13.58,50.93 总电源.2
$1N3498:
  vias: v3(18.83,14.74)
$1N3640: length 2.8
  Bottom Layer w0.254: 92.95,32.13 95.76,32.13
$1N3710: length 5.4
  Top Layer w0.254: R49.2 R47.2 63.25,32.13 63.05,32.32 Q18.1
$1N3711: length 22.1
  Top Layer w0.254: Q18.3 58.8,33.27 58.42,32.89 58.42,27.56 58.24,27.38 BUZZER.2 53.03,27.43 46.74,27.43 46.1,28.07 D8.2
$1N3941: length 7.5
  Top Layer w0.5: C40.2 D12.1 25.88,8.07 U33.3 24.95,8.06 24.77,7.87 24.77,6.35 24.95,6.16 U33.1
$1N3969: length 7.6
  Top Layer w0.5: D11.1 32.82,10.08 C97.2 31.38,9.92 U21.3 30.67,7.94 30.23,7.49 30.23,6.35 30.54,6.03 U21.1
$1N3994:
  vias: v3(18.86,7.48)
$1N4005:
  vias: v3(18.94,10.03)
$1N4007: length 20.7
  Bottom Layer w3: U39.2 4.65,32.13 arc(4.46,32.17) 4.3,32.28 2.56,34.02 arc(2.45,34.18) 2.41,34.37 2.41,44.38 arc(2.45,44.58) 2.56,44.74 4.17,46.35 arc(4.33,46.45) 4.52,46.49 6.98,46.49
$1N9076:
  vias: v3(18.83,12.32)
$1N9079: length 4.3
  Top Layer w0.6: U34.1 24.26,20.7 24.77,20.19 24.77,18.81 24.1,18.14 C43.1
$1N9082: length 8.8
  Top Layer w0.6: R55.1 26.91,20.77 R56.2 25.82,20.79 25.23,21.38 25.23,24.09 24.81,24.51 U34.4
$1N17911: length 5
  Top Layer w0.5: 70.36,36.77 70.36,36.87 70.38,36.89 ; 72.76,36.89 70.49,36.89 C20.2 70.48,37.46 71.78,38.76 D10.1
$1N37221: length 5.2
  Top Layer w0.254: KEY1.2 44.76,54.18 44.48,54.46 R3.1 C2.1
$1N37227: length 5.1
  Top Layer w0.254: 55.93,52.87 55.93,53.92 55.48,54.37 R57.1 53.85,54.42 C95.1
$1N37371: length 5.4
  Top Layer w0.254: KEY3.2 67.11,54.05 66.81,54.35 R58.1 C99.1
$1N37512: length 5.1
  Top Layer w0.254: C100.1 75.84,54.37 R59.1 77.61,54.35 77.9,54.05 KEY4.2

## Copper pours and planes (outline as drawn; the poured copper is in the pictures)
+5V on Top Layer: 28.19,19.43 36.32,19.43 36.32,8.89 28.19,8.89
GND on Top Layer: -4.45,68.2 103.89,68.2 103.89,-5.59 -4.45,-5.59
GND on Bottom Layer: -6.48,66.67 102.11,66.67 102.11,-3.3 -6.48,-3.3
GND on Inner1: -4.45,66.16 103.76,66.16 103.76,-3.68 -4.45,-3.68
GND on Inner2: -2.29,65.53 106.05,65.53 106.05,-5.84 -2.29,-5.84
$1N9081 on Top Layer: 15.82,21.21 27.43,21.21 27.43,13.08 15.82,13.08

Small or netless copper shapes (teardrops, artwork), in the pictures only: 219 on Top Layer, 83 on Bottom Layer, 34 on Inner1, 11 on Inner2

## Text on the board
Bottom Layer: 2025.7.2 | 陕西科技大学 | 幻影队
Bottom Solder Mask Layer: 2025.7.2 | 陕西科技大学 | 幻影队
Top Silkscreen Layer: GND | 3.3V | DO1 | DO2 | 5V | EN1 | EN2 | EN3 | PH1 | PH2 | RX | TX | PH3 | MCX1 | + | - | 灰度管 | 开 | 关
